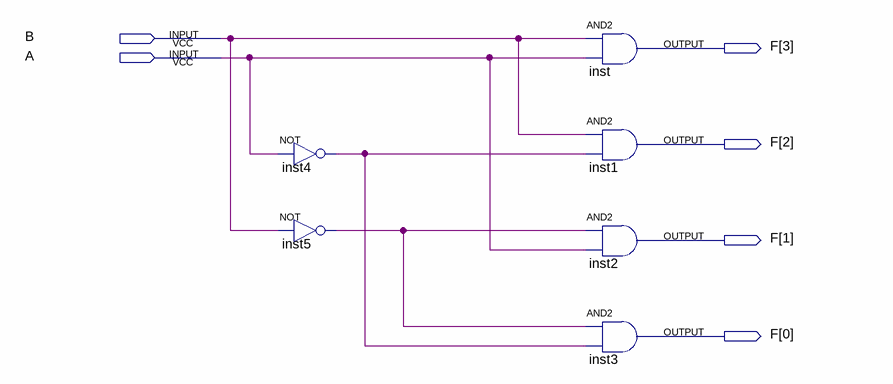
[diagram p0: schematic sheet]
// Quartus schematic decoder242130.bdf as structural Verilog: 6 symbols, 6 pins
module decoder242130 (
  input  B,
  input  A,
  output [3:0] F
);

  wire inst4_out, inst5_out;

  not inst4 (inst4_out, A);
  not inst5 (inst5_out, B);
  and inst (F[3], B, A);
  and inst1 (F[2], B, inst4_out);
  and inst2 (F[1], inst5_out, A);
  and inst3 (F[0], inst5_out, inst4_out);
endmodule
